# EAGLE design GPS Board Rev C (EAGLE 9.1.1)
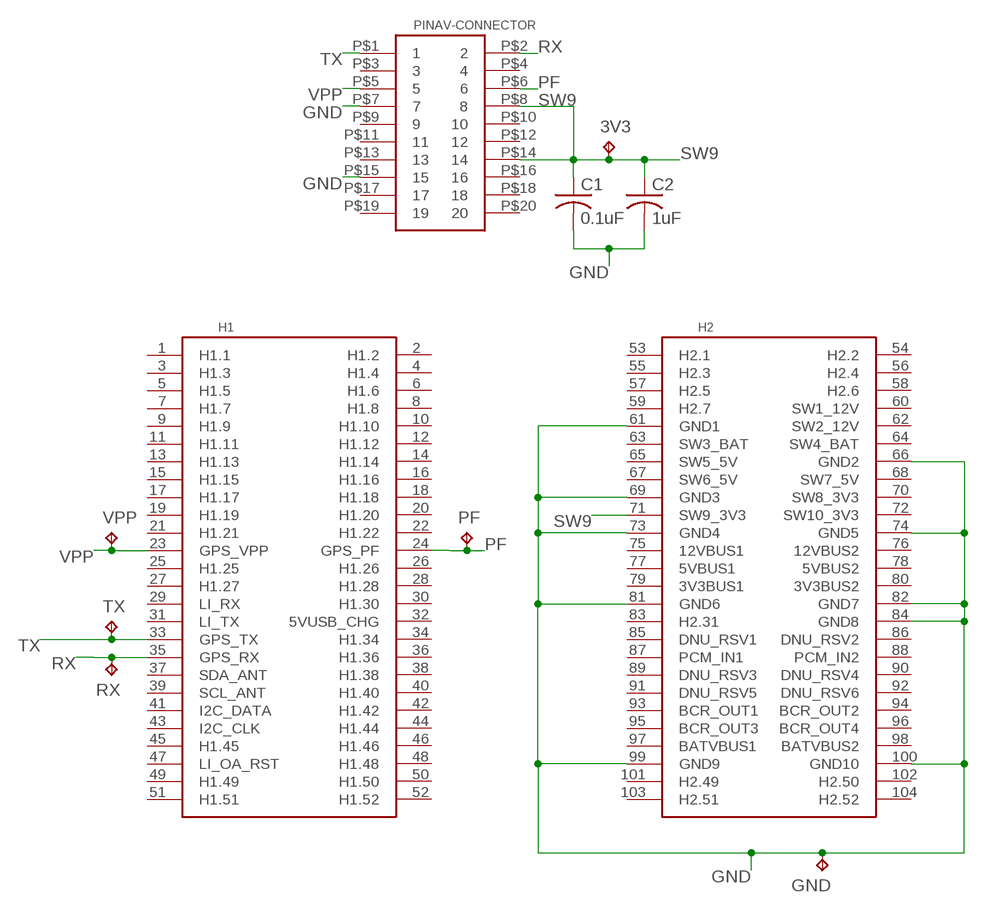
[diagram p0: schematic, sheet 1]

## Parts
3V3  TPTP10SQ  [TP10SQ]
C1  0.1uF  C-USC0805  [C0805]
C2  1uF  C-USC0805  [C0805]
GND  TPTP10SQ  [TP10SQ]
PF  TPTP10SQ  [TP10SQ]
PINAV-CONNECTOR  HLE-110-02-X-DVHLE-110-X-DV-PE-BA  [HLE-110-02-X-DV-PE-BE]
RX  TPTP10SQ  [TP10SQ]
TX  TPTP10SQ  [TP10SQ]
U$2  PC104_NO_DIMENSION  [PC104_NO_DIMENSION]
VPP  TPTP10SQ  [TP10SQ]

## Nets
GND: C1.2 C2.2 GND.TP PINAV-CONNECTOR.P$7 PINAV-CONNECTOR.P$15 U$2.61(GND1) U$2.66(GND2) U$2.69(GND3) U$2.73(GND4) U$2.74(GND5) U$2.81(GND6) U$2.82(GND7) U$2.84(GND8) U$2.99(GND9) U$2.100(GND10)
PF: PF.TP PINAV-CONNECTOR.P$6 U$2.24(GPS_PF)
RX: PINAV-CONNECTOR.P$2 RX.TP U$2.35(GPS_RX)
SW9: 3V3.TP C1.1 C2.1 PINAV-CONNECTOR.P$8 PINAV-CONNECTOR.P$14 U$2.71(SW9_3V3)
TX: PINAV-CONNECTOR.P$1 TX.TP U$2.33(GPS_TX)
VPP: PINAV-CONNECTOR.P$5 U$2.23(GPS_VPP) VPP.TP
Unconnected: PINAV-CONNECTOR.P$3 PINAV-CONNECTOR.P$4 PINAV-CONNECTOR.P$9 PINAV-CONNECTOR.P$10 PINAV-CONNECTOR.P$11 PINAV-CONNECTOR.P$12 PINAV-CONNECTOR.P$13 PINAV-CONNECTOR.P$16 PINAV-CONNECTOR.P$17 PINAV-CONNECTOR.P$18 PINAV-CONNECTOR.P$19 PINAV-CONNECTOR.P$20 U$2.1(H1.1) U$2.2(H1.2) U$2.3(H1.3) U$2.4(H1.4) U$2.5(H1.5) U$2.6(H1.6) U$2.7(H1.7) U$2.8(H1.8) U$2.9(H1.9) U$2.10(H1.10) U$2.11(H1.11) U$2.12(H1.12) U$2.13(H1.13) U$2.14(H1.14) U$2.15(H1.15) U$2.16(H1.16) U$2.17(H1.17) U$2.18(H1.18) U$2.19(H1.19) U$2.20(H1.20) U$2.21(H1.21) U$2.22(H1.22) U$2.25(H1.25) U$2.26(H1.26) U$2.27(H1.27) U$2.28(H1.28) U$2.29(LI_RX) U$2.30(H1.30) U$2.31(LI_TX) U$2.32(5VUSB_CHG) U$2.34(H1.34) U$2.36(H1.36) U$2.37(SDA_ANT) U$2.38(H1.38) U$2.39(SCL_ANT) U$2.40(H1.40) U$2.41(I2C_DATA) U$2.42(H1.42) U$2.43(I2C_CLK) U$2.44(H1.44) U$2.45(H1.45) U$2.46(H1.46) U$2.47(LI_OA_RST) U$2.48(H1.48) U$2.49(H1.49) U$2.50(H1.50) U$2.51(H1.51) U$2.52(H1.52) U$2.53(H2.1) U$2.54(H2.2) U$2.55(H2.3) U$2.56(H2.4) U$2.57(H2.5) U$2.58(H2.6) U$2.59(H2.7) U$2.60(SW1_12V) U$2.62(SW2_12V) U$2.63(SW3_BAT) U$2.64(SW4_BAT) U$2.65(SW5_5V) U$2.67(SW6_5V) U$2.68(SW7_5V) U$2.70(SW8_3V3) U$2.72(SW10_3V3) U$2.75(12VBUS1) U$2.76(12VBUS2) U$2.77(5VBUS1) U$2.78(5VBUS2) U$2.79(3V3BUS1) U$2.80(3V3BUS2) U$2.83(H2.31) U$2.85(DNU_RSV1) U$2.86(DNU_RSV2) U$2.87(PCM_IN1) U$2.88(PCM_IN2) U$2.89(DNU_RSV3) U$2.90(DNU_RSV4) U$2.91(DNU_RSV5) U$2.92(DNU_RSV6) U$2.93(BCR_OUT1) U$2.94(BCR_OUT2) U$2.95(BCR_OUT3) U$2.96(BCR_OUT4) U$2.97(BATVBUS1) U$2.98(BATVBUS2) U$2.101(H2.49) U$2.102(H2.50) U$2.103(H2.51) U$2.104(H2.52)

## Library data of the parts
3V3 GND PF RX TX VPP = testpad:TP: Test pad
C1 C2 = resistor:C-US: CAPACITOR, American symbol
PINAV-CONNECTOR = HLE-110-02-X-DV:HLE-110-02-X-DV
U$2 = Cubesat:PC104_NO_DIMENSION

## Board
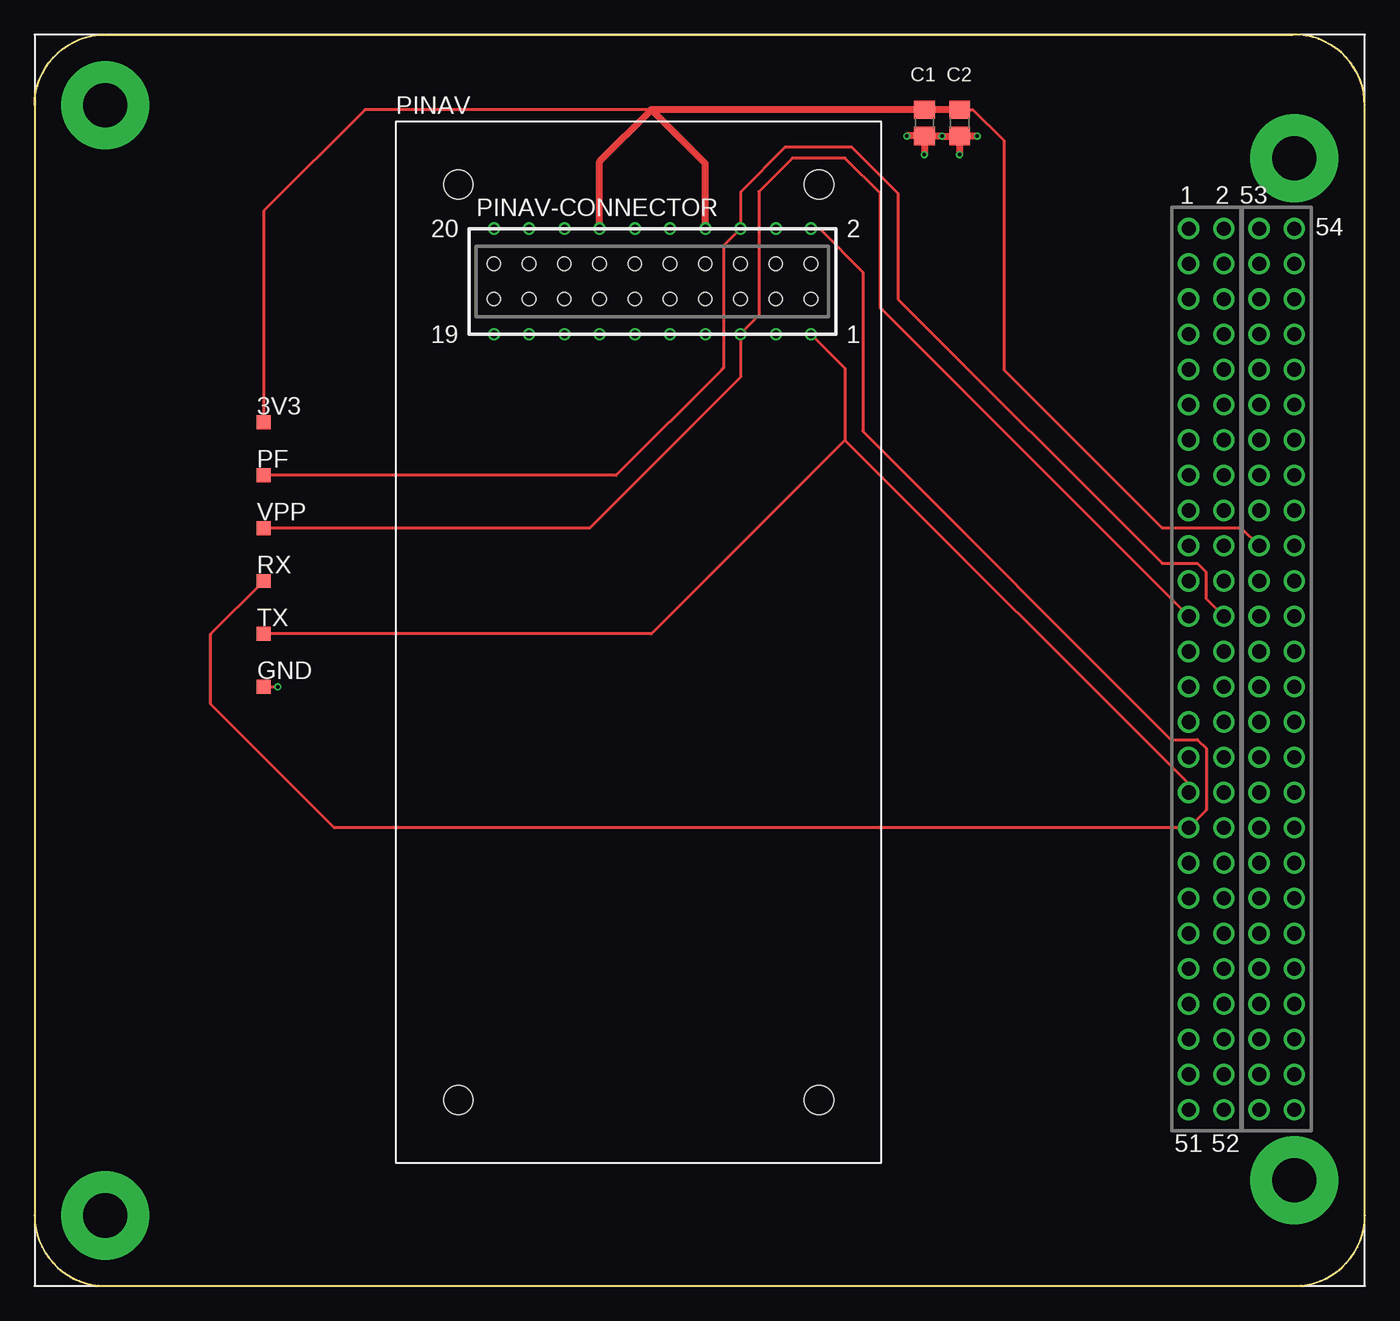
[diagram p1: board, top side]
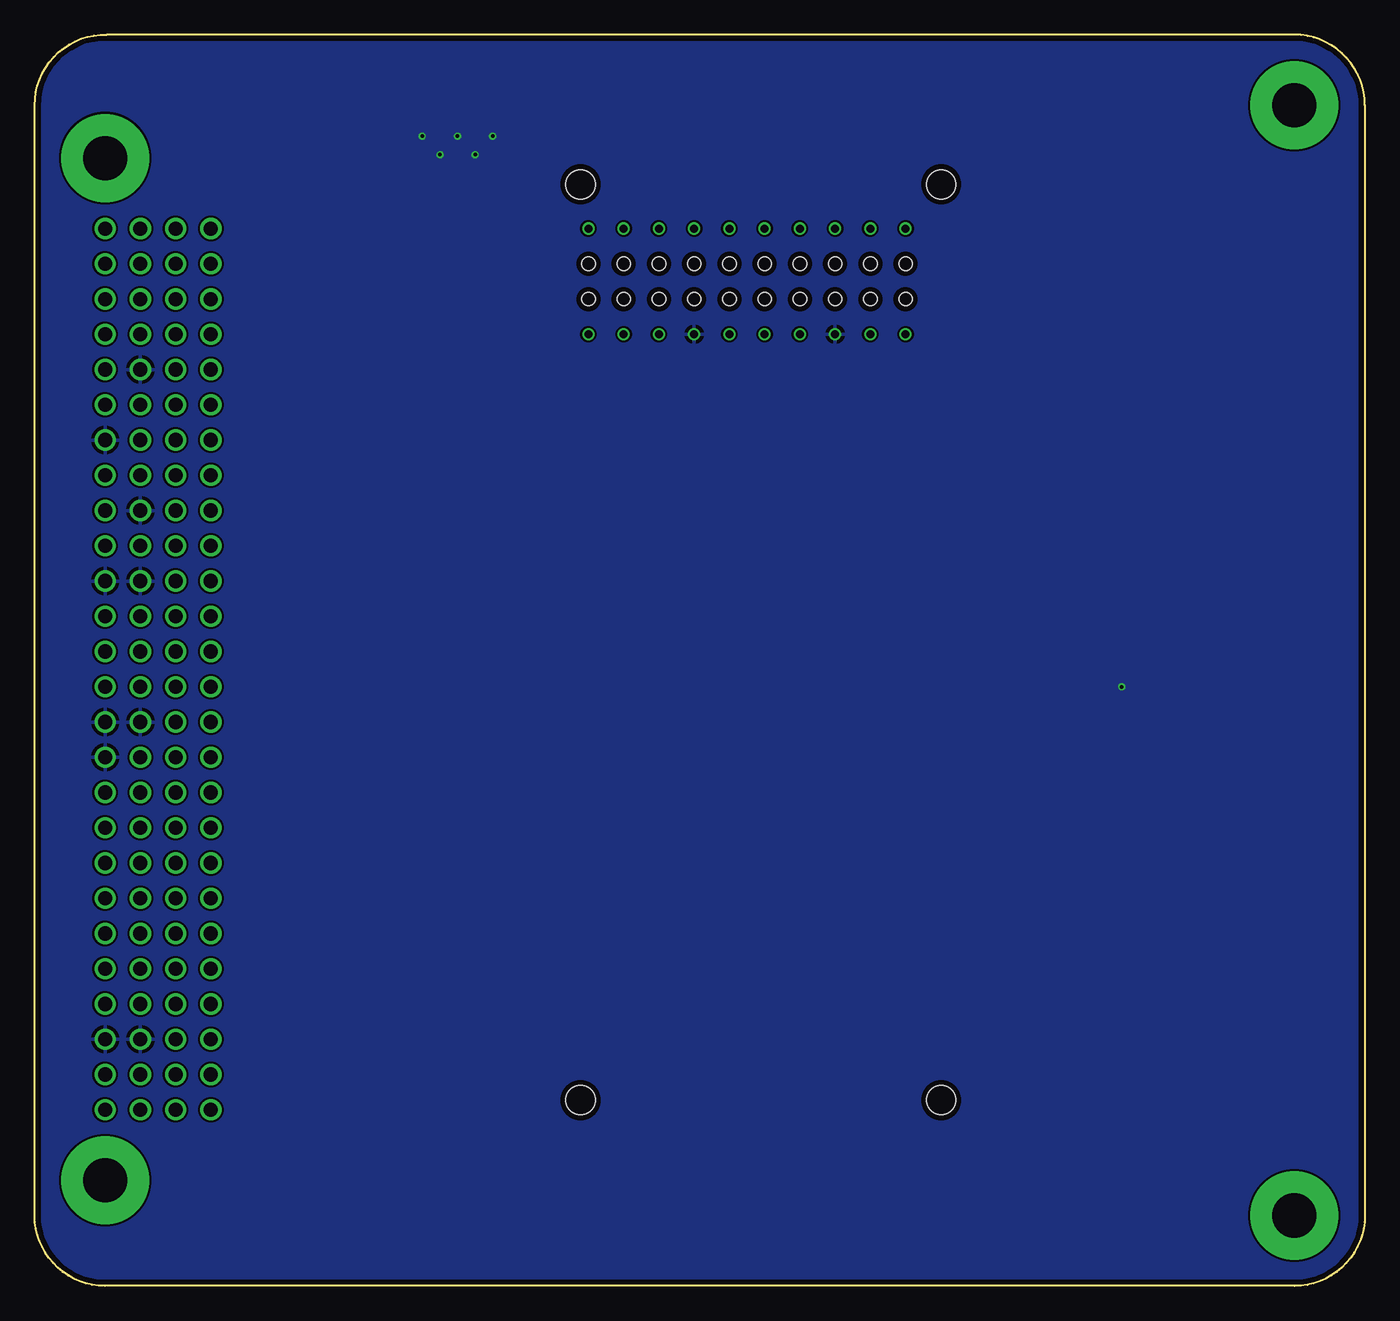
[diagram p2: board, bottom side, seen from below]

Size 95.89 x 90.17 mm. Coordinates in mm from the lower left corner, seen from the top.
Outline: 0,85.09 0,5.08 arc90 5.08,0 90.81,0 arc90 95.89,5.08 95.89,85.09 arc91 90.68,90.17 5.08,90.17 arc90 0,85.09
Copper layers (1*16): Top 0.035559375mm / dielectric 1.6mm / Bottom 0.035559375mm
Design rules "oshpark-2layer": minimum track width 6mil, minimum drill 10mil, track to track 6mil, track to pad 6mil, pad to pad 6mil, via to via 6mil, smd to smd 6mil, copper to edge 15mil, drill to drill 6mil, minimum pad ring 5mil, minimum via ring 5mil, stop-mask expansion 2.5mil, vias tented up to drill 0mil, thermal gap 10mil

### Footprints (pad centres in the part's own frame; a part is rotated, then mirrored left to right if it is on the bottom)
TP10SQ = smd 1 x 1: TP 0,0
C0805 = smd 1.3 x 1.5: 1 -0.95,0; 2 0.95,0
PINAV-L1 = hole 2.1: 30.5,4.5; 30.5,70.5; 4.5,4.5; 4.5,70.5 | hole 0.965: 7.07,64.77; 9.61,64.77; 12.15,64.77; 14.69,64.77; 17.23,64.77; 19.77,64.77; 22.31,64.77; 24.85,64.77; 27.39,64.77; 29.93,64.77; 29.93,62.23; 27.39,62.23; 24.85,62.23; 22.31,62.23; 19.77,62.23; 17.23,62.23; 14.69,62.23; 12.15,62.23; 9.61,62.23; 7.07,62.23
HLE-110-02-X-DV-PE-BE = drill 0.584: P$1 11.43,-3.81; P$2 11.43,3.81; P$3 8.89,-3.81; P$4 8.89,3.81; P$5 6.35,-3.81; P$6 6.35,3.81; P$7 3.81,-3.81; P$8 3.81,3.81; P$9 1.27,-3.81; P$10 1.27,3.81; P$11 -1.27,-3.81; P$12 -1.27,3.81; P$13 -3.81,-3.81; P$14 -3.81,3.81; P$15 -6.35,-3.81; P$16 -6.35,3.81; P$17 -8.89,-3.81; P$18 -8.89,3.81; P$19 -11.43,-3.81; P$20 -11.43,3.81
PC104_NO_DIMENSION = drill 1.016 pad 1.524: 1 83.185,76.2; 2 85.725,76.2; 3 83.185,73.66; 4 85.725,73.66; 5 83.185,71.12; 6 85.725,71.12; 7 83.185,68.58; 8 85.725,68.58; 9 83.185,66.04; 10 85.725,66.04; 11 83.185,63.5; 12 85.725,63.5; 13 83.185,60.96; 14 85.725,60.96; 15 83.185,58.42; 16 85.725,58.42; 17 83.185,55.88; 18 85.725,55.88; 19 83.185,53.34; 20 85.725,53.34; 21 83.185,50.8; 22 85.725,50.8; 23 83.185,48.26; 24 85.725,48.26; 25 83.185,45.72; 26 85.725,45.72; 27 83.185,43.18; 28 85.725,43.18; 29 83.185,40.64; 30 85.725,40.64; 31 83.185,38.1; 32 85.725,38.1; 33 83.185,35.56; 34 85.725,35.56; 35 83.185,33.02; 36 85.725,33.02; 37 83.185,30.48; 38 85.725,30.48; 39 83.185,27.94; 40 85.725,27.94; 41 83.185,25.4; 42 85.725,25.4; 43 83.185,22.86; 44 85.725,22.86; 45 83.185,20.32; 46 85.725,20.32; 47 83.185,17.78; 48 85.725,17.78; 49 83.185,15.24; 50 85.725,15.24; 51 83.185,12.7; 52 85.725,12.7; 53 88.265,76.2; 54 90.805,76.2; 55 88.265,73.66; 56 90.805,73.66; 57 88.265,71.12; 58 90.805,71.12; 59 88.265,68.58; 60 90.805,68.58; 61 88.265,66.04; 62 90.805,66.04; 63 88.265,63.5; 64 90.805,63.5; 65 88.265,60.96; 66 90.805,60.96; 67 88.265,58.42; 68 90.805,58.42; 69 88.265,55.88; 70 90.805,55.88; 71 88.265,53.34; 72 90.805,53.34; 73 88.265,50.8; 74 90.805,50.8; 75 88.265,48.26; 76 90.805,48.26; 77 88.265,45.72; 78 90.805,45.72; 79 88.265,43.18; 80 90.805,43.18; 81 88.265,40.64; 82 90.805,40.64; 83 88.265,38.1; 84 90.805,38.1; 85 88.265,35.56; 86 90.805,35.56; 87 88.265,33.02; 88 90.805,33.02; 89 88.265,30.48; 90 90.805,30.48; 91 88.265,27.94; 92 90.805,27.94; 93 88.265,25.4; 94 90.805,25.4; 95 88.265,22.86; 96 90.805,22.86; 97 88.265,20.32; 98 90.805,20.32; 99 88.265,17.78; 100 90.805,17.78; 101 88.265,15.24; 102 90.805,15.24; 103 88.265,12.7; 104 90.805,12.7 | drill 3.175 pad 6.35: MNT1 5.08,85.09; MNT2 5.08,5.08; MNT3 90.805,81.28; MNT4 90.805,7.62

### Placement (x,y rotation side)
3V3  16.51,62.23 0 top
C1  64.14,83.82 270 top
C2  66.67,83.82 270 top
GND  16.51,43.18 0 top
PF  16.51,58.42 0 top
PINAV  [PINAV-L1]  26.04,8.89 0 top
PINAV-CONNECTOR  44.53,72.39 0 top
RX  16.51,50.8 0 top
TX  16.51,46.99 0 top
U$2  0,0 0 top
VPP  16.51,54.61 0 top

### Tracks (layer width: path | path; a pad name or v marks a point on that pad's centre or on a via)
GND  (via drill 0.25)
  Top 0.203: GND.TP v17.53,43.18
  Top 0.508: C1.2 v64.14,81.53 | C2.2 v66.67,81.53 | C2.2 v65.41,82.87 C1.2 | C2.2 v67.94,82.87 | C1.2 v62.87,82.87
  pour Bottom: 0,90.17 0,0 95.89,0 95.89,90.17
PF
  Top 0.203: 54.1,82.04 58.93,82.04 62.23,78.74 62.23,71.12 81.28,52.07 83.82,52.07 84.45,51.44 84.45,49.53 U$2.24 | PF.TP 41.91,58.42 49.53,66.04 49.66,66.17 49.66,74.97 PINAV-CONNECTOR.P$6 50.88,78.83 54.1,82.04 | 54.1,82.04
RX
  Top 0.203: RX.TP 12.7,46.99 12.7,41.91 21.59,33.02 U$2.35 84.45,34.29 84.45,38.73 83.82,39.37 81.92,39.37 59.69,61.59 59.69,73.04 56.6,76.2 PINAV-CONNECTOR.P$2
SW9
  Top 0.203: U$2.71 87,54.61 81.28,54.61 69.85,66.04 69.85,82.55 67.63,84.77 C2.1 | 44.53,84.77 44.45,84.77 23.81,84.77 16.51,77.47 3V3.TP
  Top 0.508: C2.1 C1.1 44.53,84.77 | PINAV-CONNECTOR.P$14 40.73,81.05 44.45,84.77 48.34,80.88 PINAV-CONNECTOR.P$8
TX
  Top 0.203: 58.42,60.96 83.19,36.2 U$2.33 | 58.42,60.96 44.45,46.99 TX.TP | PINAV-CONNECTOR.P$1 58.42,66.12 58.42,60.96
VPP
  Top 0.203: U$2.23 60.96,70.48 60.96,78.74 58.42,81.28 54.61,81.28 52.2,78.87 52.2,69.98 PINAV-CONNECTOR.P$5 50.88,65.49 40.01,54.61 VPP.TP